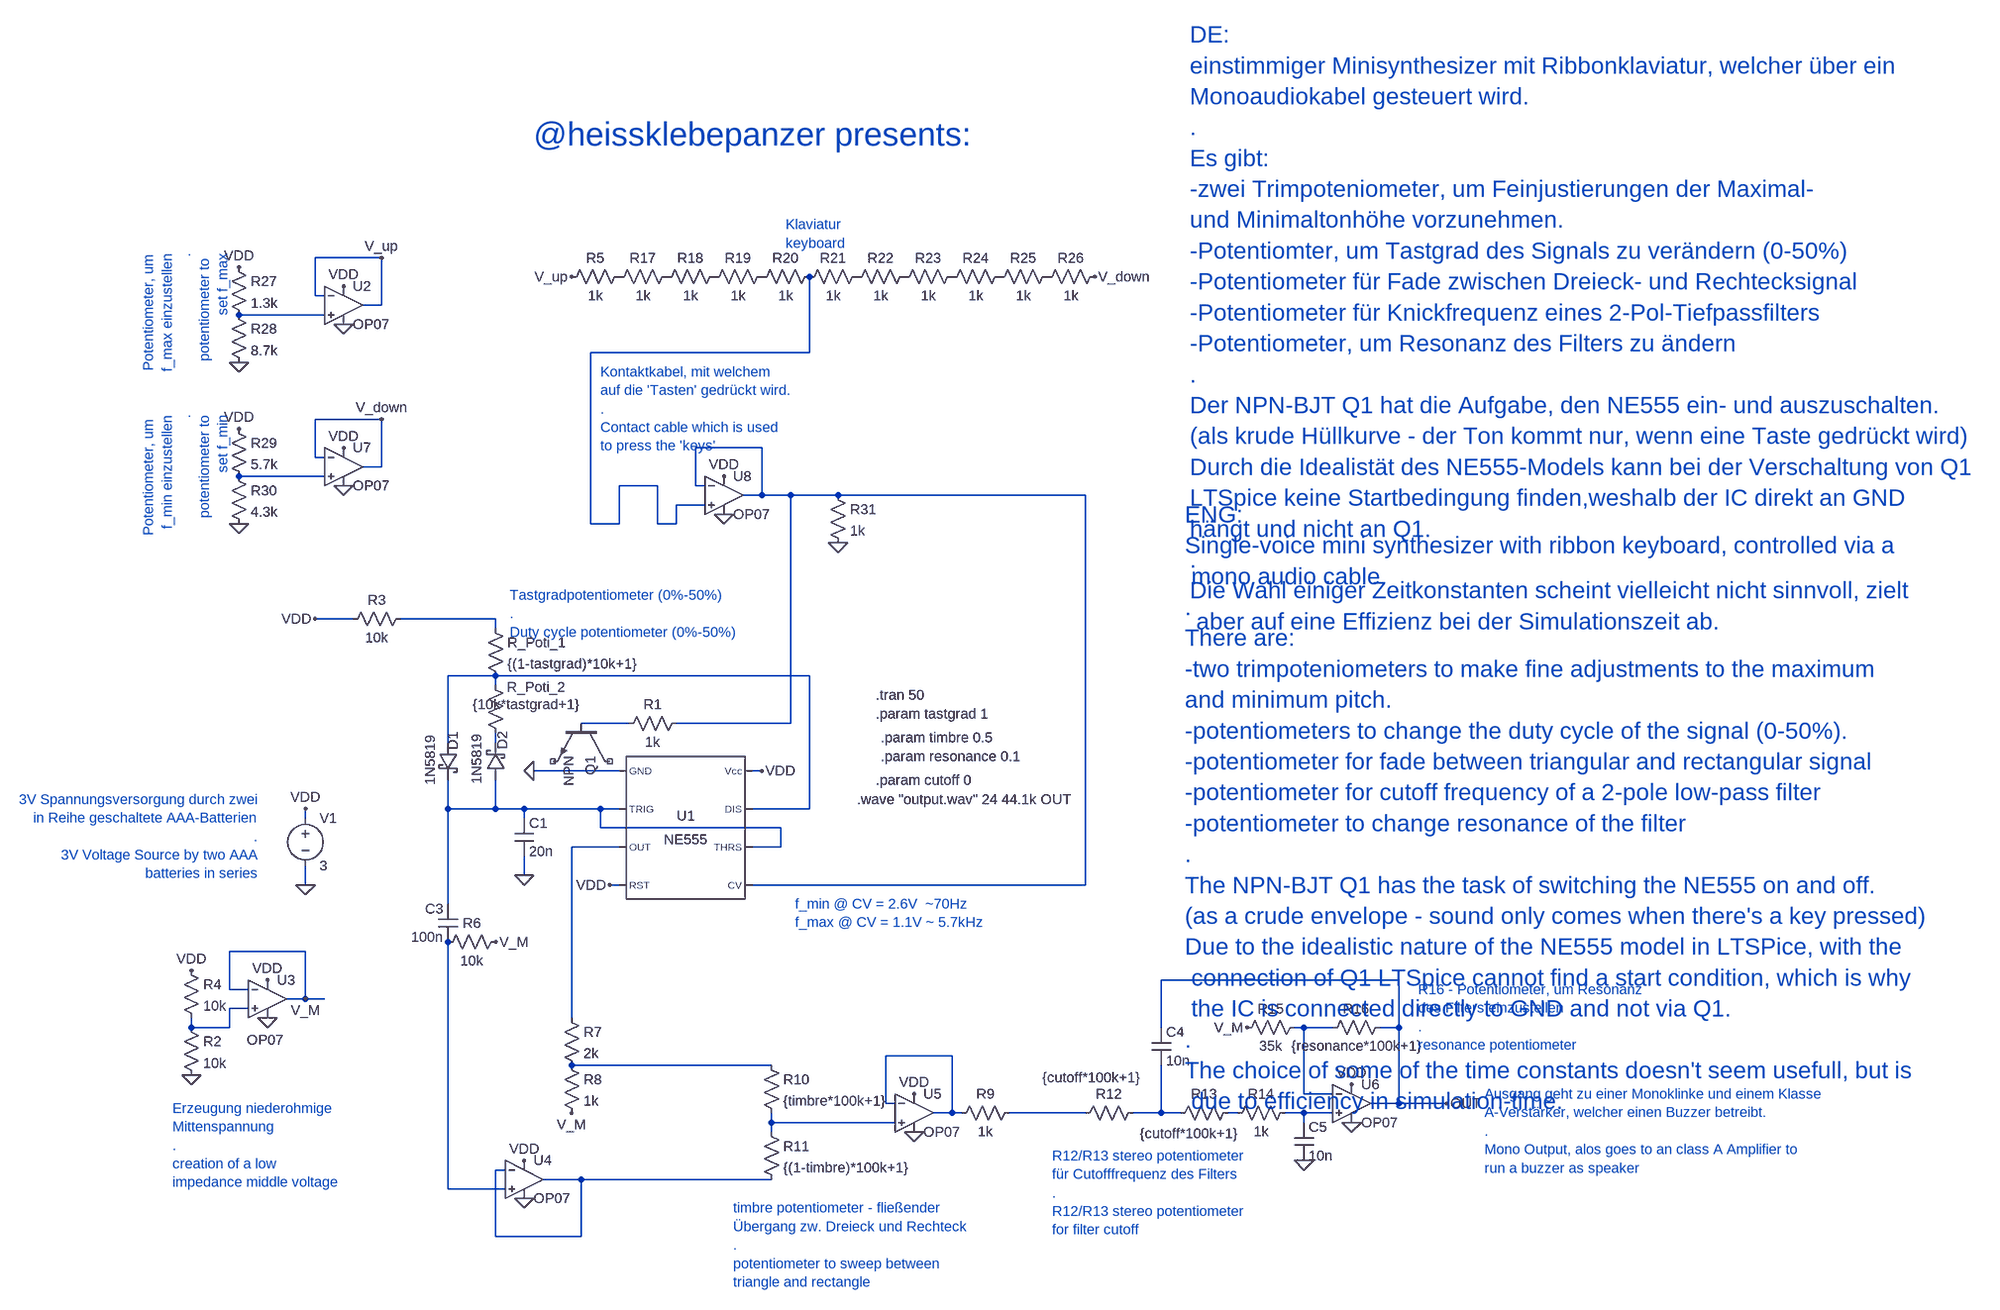
[diagram p0: schematic LTSpice_Simulation.asc]
LTSpice_Simulation.asc, the LTspice schematic file:
Version 4
SHEET 1 3884 1140
WIRE 16 -688 -96 -688
WIRE -96 -624 -96 -688
WIRE -80 -624 -96 -624
WIRE 16 -608 16 -688
WIRE 16 -608 -16 -608
WIRE -80 -592 -224 -592
WIRE 736 -528 736 -656
WIRE 736 -528 368 -528
WIRE 16 -416 -96 -416
WIRE 656 -368 544 -368
WIRE -96 -352 -96 -416
WIRE -80 -352 -96 -352
WIRE 16 -336 16 -416
WIRE 16 -336 -16 -336
WIRE -80 -320 -224 -320
WIRE 480 -304 416 -304
WIRE 544 -304 544 -368
WIRE 560 -304 544 -304
WIRE 656 -288 656 -368
WIRE 656 -288 624 -288
WIRE 704 -288 656 -288
WIRE 784 -288 704 -288
WIRE 1200 -288 784 -288
WIRE 560 -272 512 -272
WIRE 368 -240 368 -528
WIRE 416 -240 416 -304
WIRE 416 -240 368 -240
WIRE 480 -240 480 -304
WIRE 512 -240 512 -272
WIRE 512 -240 480 -240
WIRE -32 -80 -96 -80
WIRE 208 -80 48 -80
WIRE 208 -64 208 -80
WIRE 208 16 128 16
WIRE 736 16 208 16
WIRE 208 32 208 16
WIRE 432 96 352 96
WIRE 704 96 704 -288
WIRE 704 96 512 96
WIRE 128 128 128 16
WIRE 208 128 208 112
WIRE 416 176 272 176
WIRE 656 176 640 176
WIRE 128 240 128 192
WIRE 208 240 208 192
WIRE 208 240 128 240
WIRE 256 240 208 240
WIRE 384 240 256 240
WIRE 416 240 384 240
WIRE 736 240 736 16
WIRE 736 240 640 240
WIRE -112 256 -112 240
WIRE 256 256 256 240
WIRE 384 272 384 240
WIRE 688 272 384 272
WIRE 416 304 336 304
WIRE 688 304 688 272
WIRE 688 304 640 304
WIRE 256 352 256 320
WIRE -112 368 -112 336
WIRE 416 368 400 368
WIRE 1200 368 1200 -288
WIRE 1200 368 640 368
WIRE 128 400 128 240
WIRE -112 480 -240 480
WIRE 1728 528 1328 528
WIRE -240 544 -240 480
WIRE -208 544 -240 544
WIRE -112 560 -112 480
WIRE -112 560 -144 560
WIRE -80 560 -112 560
WIRE -208 576 -240 576
WIRE 336 592 336 304
WIRE -304 608 -304 592
WIRE -240 608 -240 576
WIRE -240 608 -304 608
WIRE 1328 608 1328 528
WIRE 1568 608 1552 608
WIRE 1616 608 1568 608
WIRE 1728 608 1728 528
WIRE 1728 608 1696 608
WIRE 976 656 864 656
WIRE 672 672 336 672
WIRE 1568 720 1568 608
WIRE 1616 720 1568 720
WIRE 864 736 864 656
WIRE 880 736 864 736
WIRE 1728 736 1728 608
WIRE 1728 736 1680 736
WIRE 1808 736 1728 736
WIRE 976 752 976 656
WIRE 976 752 944 752
WIRE 992 752 976 752
WIRE 1200 752 1072 752
WIRE 1328 752 1328 672
WIRE 1328 752 1280 752
WIRE 1360 752 1328 752
WIRE 1456 752 1440 752
WIRE 1568 752 1536 752
WIRE 1616 752 1568 752
WIRE 672 768 672 752
WIRE 880 768 672 768
WIRE 1568 768 1568 752
WIRE 672 784 672 768
WIRE 224 848 208 848
WIRE 352 864 288 864
WIRE 672 864 352 864
WIRE 128 880 128 464
WIRE 224 880 128 880
WIRE 208 960 208 848
WIRE 352 960 352 864
WIRE 352 960 208 960
FLAG -112 368 0
FLAG 656 176 VDD
FLAG -112 240 VDD
FLAG 272 176 0
FLAG 400 368 VDD
FLAG 256 352 0
FLAG -96 -80 VDD
FLAG -304 688 0
FLAG -304 512 VDD
FLAG -176 528 VDD
FLAG -176 592 0
FLAG -112 560 V_M
FLAG 256 896 0
FLAG 256 832 VDD
FLAG 336 752 V_M
FLAG 912 784 0
FLAG 912 720 VDD
FLAG 1568 832 0
FLAG 1648 768 0
FLAG 1648 704 VDD
FLAG 1472 608 V_M
FLAG 208 464 V_M
FLAG 1808 736 OUT
FLAG -224 -672 VDD
FLAG -224 -400 VDD
FLAG -224 -512 0
FLAG -224 -240 0
FLAG -48 -576 0
FLAG -48 -304 0
FLAG -48 -640 VDD
FLAG -48 -368 VDD
FLAG 16 -688 V_up
FLAG 1216 -656 V_down
FLAG 336 -656 V_up
FLAG 16 -416 V_down
FLAG 592 -256 0
FLAG 592 -320 VDD
FLAG 784 -208 0
SYMBOL Misc/NE555 528 272 R0
SYMATTR InstName U1
SYMBOL voltage -112 240 R0
SYMATTR InstName V1
SYMATTR Value 3
SYMBOL schottky 112 128 R0
WINDOW 0 25 -17 VRight 2
WINDOW 3 65 -14 VRight 2
SYMATTR InstName D1
SYMATTR Value 1N5819
SYMATTR Description Diode
SYMATTR Type diode
SYMBOL schottky 224 192 R180
WINDOW 0 4 51 VRight 2
WINDOW 3 126 -9 VRight 2
SYMATTR InstName D2
SYMATTR Value 1N5819
SYMATTR Description Diode
SYMATTR Type diode
SYMBOL cap 240 256 R0
SYMATTR InstName C1
SYMATTR Value 20n
SYMBOL res 224 128 R180
WINDOW 0 -102 93 Left 2
WINDOW 3 -125 64 Left 2
SYMATTR InstName R_Poti_2
SYMATTR Value {10k*tastgrad+1}
SYMBOL res 192 -80 R0
SYMATTR InstName R_Poti_1
SYMATTR Value {(1-tastgrad)*10k+1}
SYMBOL res -48 -64 R270
WINDOW 0 32 56 VTop 2
WINDOW 3 0 56 VBottom 2
SYMATTR InstName R3
SYMATTR Value 10k
SYMBOL OpAmps/OP07 -176 496 R0
WINDOW 3 -35 133 Left 2
SYMATTR InstName U3
SYMBOL res -320 592 R0
SYMATTR InstName R2
SYMATTR Value 10k
SYMBOL res -320 496 R0
SYMATTR InstName R4
SYMATTR Value 10k
SYMBOL res 320 576 R0
SYMATTR InstName R7
SYMATTR Value 2k
SYMBOL res 320 656 R0
SYMATTR InstName R8
SYMATTR Value 1k
SYMBOL OpAmps/OP07 912 688 R0
SYMATTR InstName U5
SYMBOL res 1088 736 R90
WINDOW 0 0 56 VBottom 2
WINDOW 3 32 56 VTop 2
SYMATTR InstName R9
SYMATTR Value 1k
SYMBOL res 656 656 R0
SYMATTR InstName R10
SYMATTR Value {timbre*100k+1}
SYMBOL res 656 768 R0
SYMATTR InstName R11
SYMATTR Value {(1-timbre)*100k+1}
SYMBOL res 1296 736 R90
WINDOW 0 0 56 VBottom 2
WINDOW 3 -59 86 VTop 2
SYMATTR InstName R12
SYMATTR Value {cutoff*100k+1}
SYMBOL res 1456 736 R90
WINDOW 0 0 56 VBottom 2
WINDOW 3 35 82 VTop 2
SYMATTR InstName R13
SYMATTR Value {cutoff*100k+1}
SYMBOL cap 1312 608 R0
SYMATTR InstName C4
SYMATTR Value 10n
SYMBOL cap 1552 768 R0
SYMATTR InstName C5
SYMATTR Value 10n
SYMBOL res 1552 736 R90
WINDOW 0 0 56 VBottom 2
WINDOW 3 32 56 VTop 2
SYMATTR InstName R14
SYMATTR Value 1k
SYMBOL res 1568 592 R90
WINDOW 0 0 56 VBottom 2
WINDOW 3 32 56 VTop 2
SYMATTR InstName R15
SYMATTR Value 35k
SYMBOL res 1712 592 R90
WINDOW 0 0 56 VBottom 2
WINDOW 3 32 56 VTop 2
SYMATTR InstName R16
SYMATTR Value {resonance*100k+1}
SYMBOL OpAmps/OP07 1648 672 R0
SYMATTR InstName U6
SYMBOL cap 144 464 R180
WINDOW 0 24 56 Left 2
WINDOW 3 24 8 Left 2
SYMATTR InstName C3
SYMATTR Value 100n
SYMBOL res 224 448 R90
WINDOW 0 0 56 VBottom 2
WINDOW 3 32 56 VTop 2
SYMATTR InstName R6
SYMATTR Value 10k
SYMBOL OpAmps/OP07 256 800 R0
SYMATTR InstName U4
SYMBOL res 528 80 R90
WINDOW 0 0 56 VBottom 2
WINDOW 3 32 56 VTop 2
SYMATTR InstName R1
SYMATTR Value 1k
SYMBOL res 432 -672 R90
WINDOW 0 0 56 VBottom 2
WINDOW 3 32 56 VTop 2
SYMATTR InstName R5
SYMATTR Value 1k
SYMBOL res 512 -672 R90
WINDOW 0 0 56 VBottom 2
WINDOW 3 32 56 VTop 2
SYMATTR InstName R17
SYMATTR Value 1k
SYMBOL res 592 -672 R90
WINDOW 0 0 56 VBottom 2
WINDOW 3 32 56 VTop 2
SYMATTR InstName R18
SYMATTR Value 1k
SYMBOL res 672 -672 R90
WINDOW 0 0 56 VBottom 2
WINDOW 3 32 56 VTop 2
SYMATTR InstName R19
SYMATTR Value 1k
SYMBOL res 752 -672 R90
WINDOW 0 0 56 VBottom 2
WINDOW 3 32 56 VTop 2
SYMATTR InstName R20
SYMATTR Value 1k
SYMBOL res 832 -672 R90
WINDOW 0 0 56 VBottom 2
WINDOW 3 32 56 VTop 2
SYMATTR InstName R21
SYMATTR Value 1k
SYMBOL res 912 -672 R90
WINDOW 0 0 56 VBottom 2
WINDOW 3 32 56 VTop 2
SYMATTR InstName R22
SYMATTR Value 1k
SYMBOL res 992 -672 R90
WINDOW 0 0 56 VBottom 2
WINDOW 3 32 56 VTop 2
SYMATTR InstName R23
SYMATTR Value 1k
SYMBOL res 1072 -672 R90
WINDOW 0 0 56 VBottom 2
WINDOW 3 32 56 VTop 2
SYMATTR InstName R24
SYMATTR Value 1k
SYMBOL res 1152 -672 R90
WINDOW 0 0 56 VBottom 2
WINDOW 3 32 56 VTop 2
SYMATTR InstName R25
SYMATTR Value 1k
SYMBOL res 1232 -672 R90
WINDOW 0 0 56 VBottom 2
WINDOW 3 32 56 VTop 2
SYMATTR InstName R26
SYMATTR Value 1k
SYMBOL res -240 -688 R0
SYMATTR InstName R27
SYMATTR Value 1.3k
SYMBOL res -240 -608 R0
SYMATTR InstName R28
SYMATTR Value 8.7k
SYMBOL res -240 -416 R0
SYMATTR InstName R29
SYMATTR Value 5.7k
SYMBOL res -240 -336 R0
SYMATTR InstName R30
SYMATTR Value 4.3k
SYMBOL OpAmps/OP07 -48 -672 R0
SYMATTR InstName U2
SYMBOL OpAmps/OP07 -48 -400 R0
SYMATTR InstName U7
SYMBOL OpAmps/OP07 592 -352 R0
SYMATTR InstName U8
SYMBOL res 768 -304 R0
SYMATTR InstName R31
SYMATTR Value 1k
SYMBOL npn 400 96 R90
SYMATTR InstName Q1
TEXT 848 48 Left 2 !.tran 50
TEXT 848 80 Left 2 !.param tastgrad 1
TEXT 712 400 Left 2 ;f_min @ CV = 2.6V  ~70Hz\nf_max @ CV = 1.1V ~ 5.7kHz
TEXT 232 -120 Left 2 ;Tastgradpotentiometer (0%-50%)\n.\nDuty cycle potentiometer (0%-50%)
TEXT -192 224 Right 2 ;3V Spannungsversorgung durch zwei\nin Reihe geschaltete AAA-Batterien\n.\n3V Voltage Source by two AAA\nbatteries in series
TEXT -336 744 Left 2 ;Erzeugung niederohmige \nMittenspannung\n.\ncreation of a low\nimpedance middle voltage
TEXT 856 120 Left 2 !.param timbre 0.5
TEXT 1144 824 Left 2 ;R12/R13 stereo potentiometer\nfür Cutofffrequenz des Filters\n.\nR12/R13 stereo potentiometer\nfor filter cutoff
TEXT 608 912 Left 2 ;timbre potentiometer - fließender\nÜbergang zw. Dreieck und Rechteck\n.\npotentiometer to sweep between \ntriangle and rectangle
TEXT 1760 544 Left 2 ;R16 - Potentiometer, um Resonanz \ndes Filters einzustellen\n.\nresonance potentiometer
TEXT 856 152 Left 2 !.param resonance 0.1
TEXT 848 192 Left 2 !.param cutoff 0
TEXT 1872 720 Left 2 ;Ausgang geht zu einer Monoklinke und einem Klasse \nA-Verstärker, welcher einen Buzzer betreibt.\n.\nMono Output, alos goes to an class A Amplifier to \nrun a buzzer as speaker
TEXT 696 -744 Left 2 ;Klaviatur\nkeyboard
TEXT 384 -496 Left 2 ;Kontaktkabel, mit welchem \nauf die 'Tasten' gedrückt wird.\n.\nContact cable which is used\nto press the 'keys'
TEXT -376 -424 VRight 2 ;Potentiometer, um \nf_min einzustellen\n.\npotentiometer to\nset f_min
TEXT -376 -696 VRight 2 ;Potentiometer, um\nf_max einzustellen\n.\npotentiometer to \nset f_max
TEXT 1376 -1064 Left 4 ;DE:\neinstimmiger Minisynthesizer mit Ribbonklaviatur, welcher über ein \nMonoaudiokabel gesteuert wird.\n.\nEs gibt: \n-zwei Trimpoteniometer, um Feinjustierungen der Maximal- \nund Minimaltonhöhe vorzunehmen.\n-Potentiomter, um Tastgrad des Signals zu verändern (0-50%)\n-Potentiometer für Fade zwischen Dreieck- und Rechtecksignal\n-Potentiometer für Knickfrequenz eines 2-Pol-Tiefpassfilters\n-Potentiometer, um Resonanz des Filters zu ändern\n.\nDer NPN-BJT Q1 hat die Aufgabe, den NE555 ein- und auszuschalten.\n(als krude Hüllkurve - der Ton kommt nur, wenn eine Taste gedrückt wird)\nDurch die Idealistät des NE555-Models kann bei der Verschaltung von Q1 \nLTSpice keine Startbedingung finden,weshalb der IC direkt an GND \nhängt und nicht an Q1.\n.\nDie Wahl einiger Zeitkonstanten scheint vielleicht nicht sinnvoll, zielt\n aber auf eine Effizienz bei der Simulationszeit ab.
TEXT 816 224 Left 2 !.wave "output.wav" 24 44.1k OUT
TEXT 1368 -256 Left 4 ;ENG:\nSingle-voice mini synthesizer with ribbon keyboard, controlled via a \n mono audio cable.\n.\nThere are: \n-two trimpoteniometers to make fine adjustments to the maximum \nand minimum pitch.\n-potentiometers to change the duty cycle of the signal (0-50%).\n-potentiometer for fade between triangular and rectangular signal\n-potentiometer for cutoff frequency of a 2-pole low-pass filter\n-potentiometer to change resonance of the filter\n.\nThe NPN-BJT Q1 has the task of switching the NE555 on and off.\n(as a crude envelope - sound only comes when there's a key pressed)\nDue to the idealistic nature of the NE555 model in LTSPice, with the\n connection of Q1 LTSpice cannot find a start condition, which is why\n the IC is connected directly to GND and not via Q1.\n.\nThe choice of some of the time constants doesn't seem usefull, but is\n due to efficiency in simulation-time.
TEXT 272 -896 Left 5 ;@heissklebepanzer presents:

The netlist it stands for:
* LTSpice_Simulation.asc
XU1 0 N009 N010 VDD N003 N009 N006 VDD NE555  ; pins GND TRIG OUT RST CV THRS DIS Vcc
V1 VDD 0 3
D1 N006 N009 1N5819
D2 N009 N008 1N5819
C1 N009 0 20n
R_Poti_2 N008 N006 {10k*tastgrad+1}
R_Poti_1 N005 N006 {(1-tastgrad)*10k+1}
R3 VDD N005 10k
XU3 N011 V_M VDD 0 V_M LT1001  ; OP07, pins In+ In- V+ V- OUT
R2 N011 0 10k
R4 VDD N011 10k
R7 N010 N014 2k
R8 N014 V_M 1k
XU5 N019 N013 VDD 0 N013 LT1001  ; OP07, pins In+ In- V+ V- OUT
R9 N015 N013 1k
R10 N014 N019 {timbre*100k+1}
R11 N019 N020 {(1-timbre)*100k+1}
R12 N016 N015 {cutoff*100k+1}
R13 N017 N016 {cutoff*100k+1}
C4 OUT N016 10n
C5 N018 0 10n
R14 N018 N017 1k
R15 N012 V_M 35k
R16 OUT N012 {resonance*100k+1}
XU6 N018 N012 VDD 0 OUT LT1001  ; OP07, pins In+ In- V+ V- OUT
C3 N021 N009 100n
R6 V_M N021 10k
XU4 N021 N020 VDD 0 N020 LT1001  ; OP07, pins In+ In- V+ V- OUT
R1 N003 N007 1k
R5 P001 V_up 1k
R17 P002 P001 1k
R18 P003 P002 1k
R19 P004 P003 1k
R20 N002 P004 1k
R21 P005 N002 1k
R22 P006 P005 1k
R23 P007 P006 1k
R24 P008 P007 1k
R25 P009 P008 1k
R26 V_down P009 1k
R27 VDD N001 1.3k
R28 N001 0 8.7k
R29 VDD N004 5.7k
R30 N004 0 4.3k
XU2 N001 V_up VDD 0 V_up LT1001  ; OP07, pins In+ In- V+ V- OUT
XU7 N004 V_down VDD 0 V_down LT1001  ; OP07, pins In+ In- V+ V- OUT
XU8 N002 N003 VDD 0 N003 LT1001  ; OP07, pins In+ In- V+ V- OUT
R31 N003 0 1k
Q1 NC_01 N007 NC_02 0 NPN
.model D D
.lib standard.dio
.model NPN NPN
.model PNP PNP
.lib standard.bjt
.tran 50
.param tastgrad 1
* f_min @ CV = 2.6V  ~70Hz
* f_max @ CV = 1.1V ~ 5.7kHz
* Tastgradpotentiometer (0%-50%)
* .
* Duty cycle potentiometer (0%-50%)
* 3V Spannungsversorgung durch zwei
* in Reihe geschaltete AAA-Batterien
* .
* 3V Voltage Source by two AAA
* batteries in series
* Erzeugung niederohmige
* Mittenspannung
* .
* creation of a low
* impedance middle voltage
.param timbre 0.5
* R12/R13 stereo potentiometer
* für Cutofffrequenz des Filters
* .
* R12/R13 stereo potentiometer
* for filter cutoff
* timbre potentiometer - fließender
* Übergang zw. Dreieck und Rechteck
* .
* potentiometer to sweep between
* triangle and rectangle
* R16 - Potentiometer, um Resonanz
* des Filters einzustellen
* .
* resonance potentiometer
.param resonance 0.1
.param cutoff 0
* Ausgang geht zu einer Monoklinke und einem Klasse
* A-Verstärker, welcher einen Buzzer betreibt.
* .
* Mono Output, alos goes to an class A Amplifier to
* run a buzzer as speaker
* Klaviatur
* keyboard
* Kontaktkabel, mit welchem
* auf die 'Tasten' gedrückt wird.
* .
* Contact cable which is used
* to press the 'keys'
* Potentiometer, um
* f_min einzustellen
* .
* potentiometer to
* set f_min
* Potentiometer, um
* f_max einzustellen
* .
* potentiometer to
* set f_max
* DE:
* einstimmiger Minisynthesizer mit Ribbonklaviatur, welcher über ein
* Monoaudiokabel gesteuert wird.
* .
* Es gibt:
* -zwei Trimpoteniometer, um Feinjustierungen der Maximal-
* und Minimaltonhöhe vorzunehmen.
* -Potentiomter, um Tastgrad des Signals zu verändern (0-50%)
* -Potentiometer für Fade zwischen Dreieck- und Rechtecksignal
* -Potentiometer für Knickfrequenz eines 2-Pol-Tiefpassfilters
* -Potentiometer, um Resonanz des Filters zu ändern
* .
* Der NPN-BJT Q1 hat die Aufgabe, den NE555 ein- und auszuschalten.
* (als krude Hüllkurve - der Ton kommt nur, wenn eine Taste gedrückt wird)
* Durch die Idealistät des NE555-Models kann bei der Verschaltung von Q1
* LTSpice keine Startbedingung finden,weshalb der IC direkt an GND
* hängt und nicht an Q1.
* .
* Die Wahl einiger Zeitkonstanten scheint vielleicht nicht sinnvoll, zielt
*  aber auf eine Effizienz bei der Simulationszeit ab.
.wave "output.wav" 24 44.1k OUT
* ENG:
* Single-voice mini synthesizer with ribbon keyboard, controlled via a
*  mono audio cable.
* .
* There are:
* -two trimpoteniometers to make fine adjustments to the maximum
* and minimum pitch.
* -potentiometers to change the duty cycle of the signal (0-50%).
* -potentiometer for fade between triangular and rectangular signal
* -potentiometer for cutoff frequency of a 2-pole low-pass filter
* -potentiometer to change resonance of the filter
* .
* The NPN-BJT Q1 has the task of switching the NE555 on and off.
* (as a crude envelope - sound only comes when there's a key pressed)
* Due to the idealistic nature of the NE555 model in LTSPice, with the
*  connection of Q1 LTSpice cannot find a start condition, which is why
*  the IC is connected directly to GND and not via Q1.
* .
* The choice of some of the time constants doesn't seem usefull, but is
*  due to efficiency in simulation-time.
* @heissklebepanzer presents:
.lib NE555.sub
.lib LTC.lib
.backanno
.end